# Altium schematic sheet Uarts.SchDoc
size A4; SheetNumber: 4; SheetTotal: 8
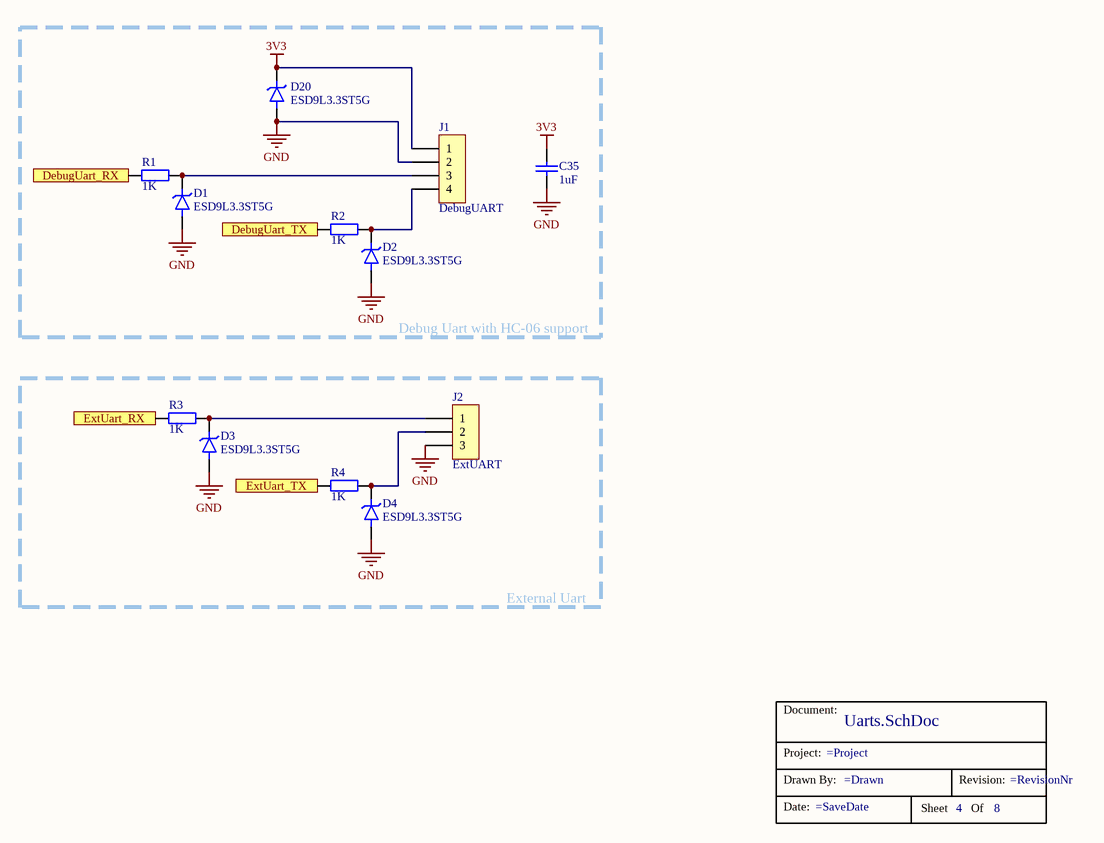
[diagram p0: Uarts.SchDoc]

## Parts
*  TitleBox  (value not drawn)
C35  Capacitance: 1uF  [C0603 N]
D1  ESD9L3.3ST5G  [SOD923F, NOMINAL]
D2  ESD9L3.3ST5G  [SOD923F, NOMINAL]
D3  ESD9L3.3ST5G  [SOD923F, NOMINAL]
D4  ESD9L3.3ST5G  [SOD923F, NOMINAL]
D20  ESD9L3.3ST5G  [SOD923F, NOMINAL]
J1  DebugUART  [female 1x4 vertical]
J2  ExtUART  [UART_HEADER]
R1  1K  [R0603]
R2  1K  [R0603]
R3  1K  [R0603]
R4  1K  [R0603]

## Blocks framed on the sheet
Debug Uart with HC-06 support: C35 D1 D2 D20 J1 R1 R2
External Uart: D3 D4 J2 R3 R4

## Ports
DebugUart_RX (out), DebugUart_TX (in), ExtUart_RX (out), ExtUart_TX (in)

## Nets
3V3: C35.2 D20.C J1.1
GND: C35.1 D1.A D2.A D3.A D4.A D20.A J1.2 J2.3
DebugUart_RX: R1.2 ; port DebugUart_RX
DebugUart_TX: R2.2 ; port DebugUart_TX
ExtUart_RX: R3.2 ; port ExtUart_RX
ExtUart_TX: R4.2 ; port ExtUart_TX
NetD1_C: D1.C J1.3 R1.1
NetD2_C: D2.C J1.4 R2.1
NetD3_C: D3.C J2.1 R3.1
NetD4_C: D4.C J2.2 R4.1

## Notes on the sheet
- (in symbol TitleBox) Document:; Project:; Drawn By:; Revision:; Date:; Sheet; Of

## Library data of the parts
C35 = Capacitor: Ceramic capacitor; Type: MLCC; Voltage rating: *V; Characteristic: *; Manufacturer: *; Note: C0603 N
D1-D4 D20 = ESD9L3.3ST5G: TVS DIODE, Unidir, 3.3V/9V, 150mW, SOD-923, ESD9L3.3ST5G, ON SEMICONDUCTOR; Clamping Voltage: 9V; Reverse Standoff Voltage: 3.3V; Breakdown Voltage: 4.8V; Peak Pulse Current: 1A; Leakage Current: 1uA; Supplier 1: Farnell; Manufacturer: ON Semiconductor; Manufacturer Part Number: ESD9L3.3ST5G; Case/Package: SOD-923-2; Operating Temperature Range: -55 .. 125°C; Peak Pulse Power: 150mW; ComponentLink1URL: https://www.verical.com/server-webapp/html/getDatasheet?partID=148186&src-supplier=Verical; ComponentLink1Description: Datasheet; Supplier Part Number 1: 2533269
J1 = header 1x4 vertical
J2 = header 1x3 vertical
R1-R4 = Resistor: Precision: *%; Voltage rating: *V; Temp coefficient: *ppm; Power rating: *mW; Manufacturer: *; Resistance: 1K; Note: R0603